# Altium schematic sheet STM32H730_PINOUT.SchDoc
size D; SheetNumber: 4; SheetTotal: 4
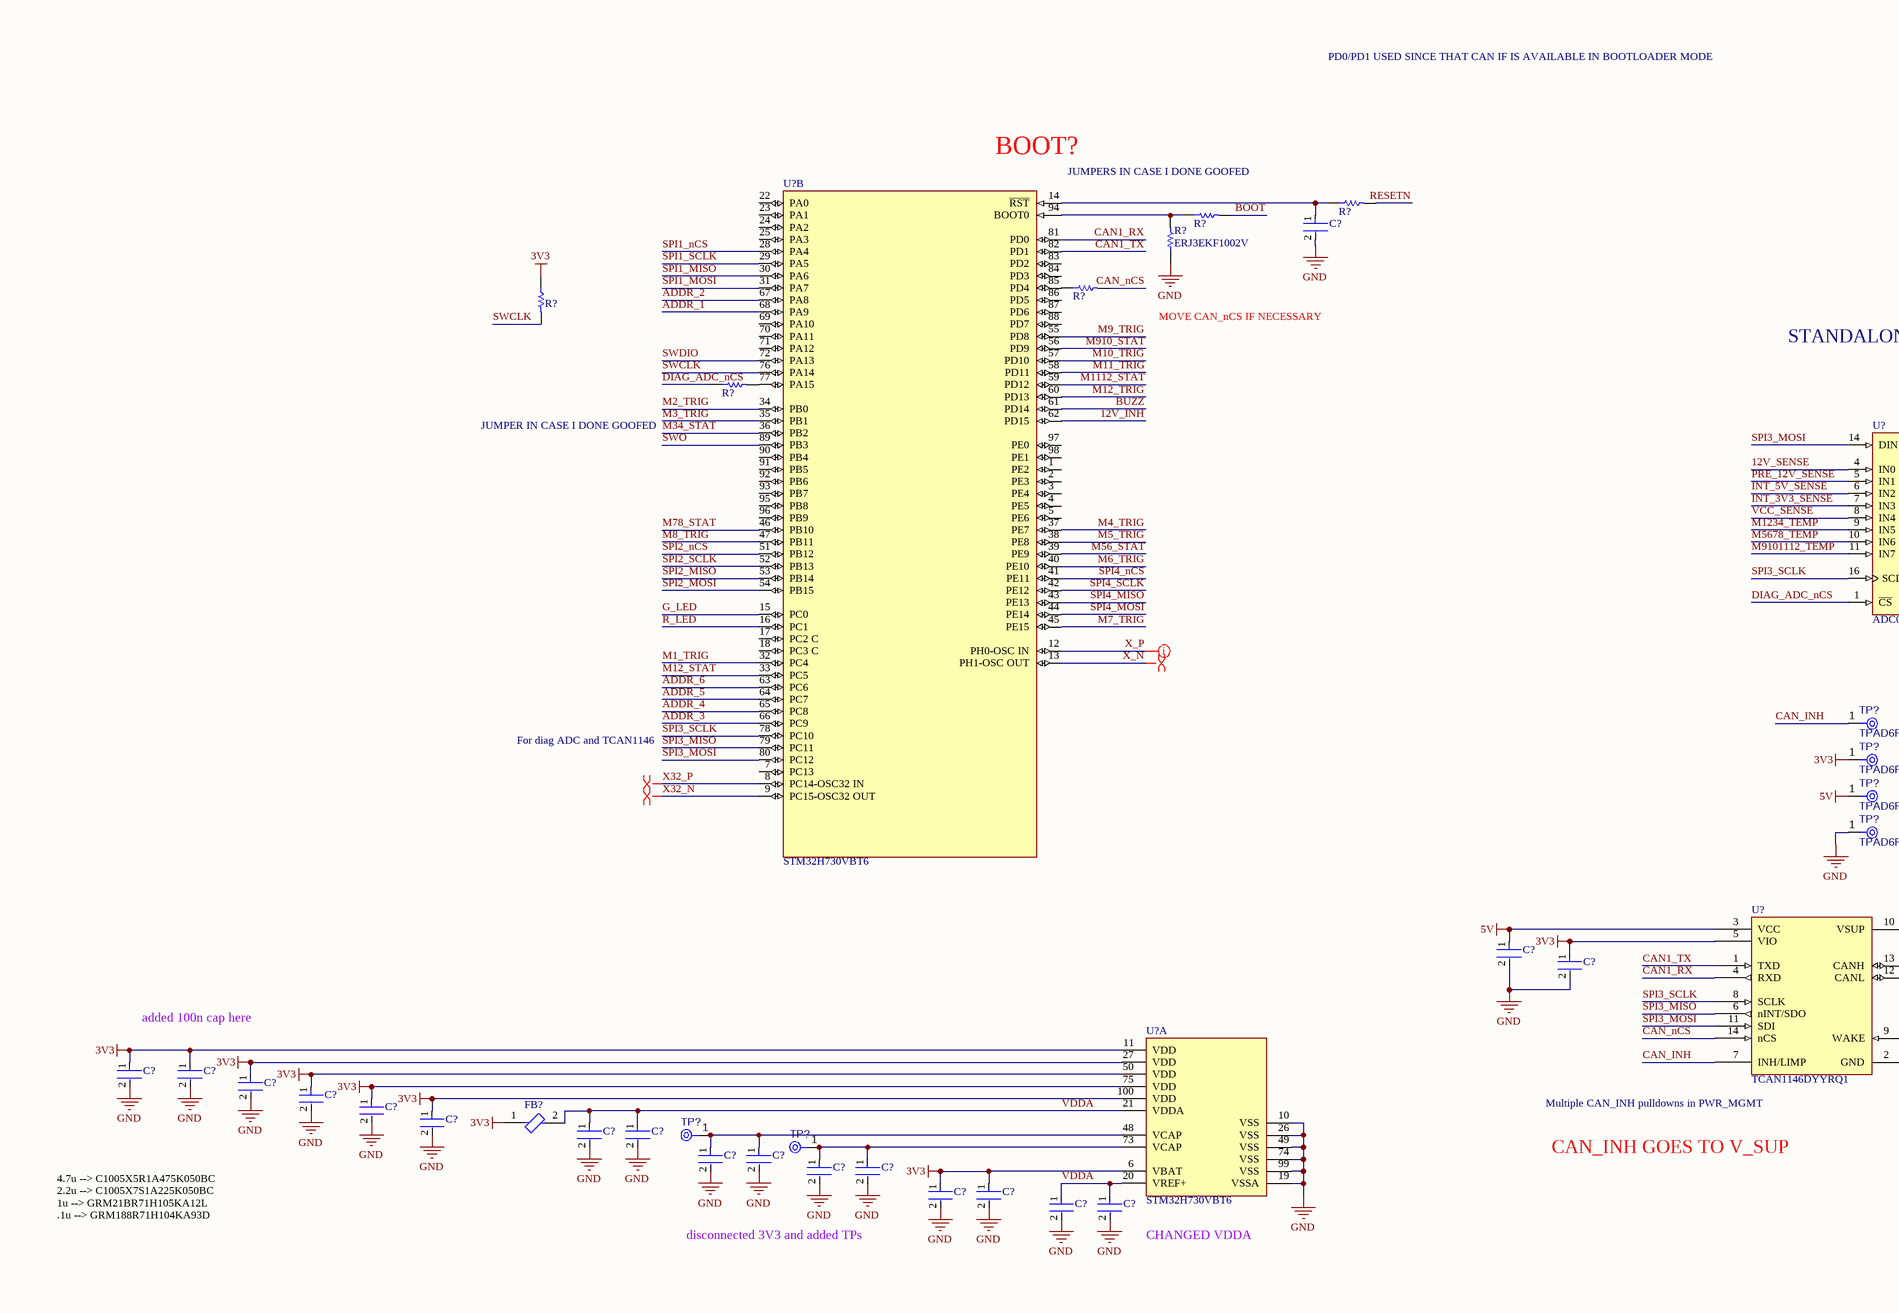
[diagram p0: STM32H730_PINOUT.SchDoc, top left]
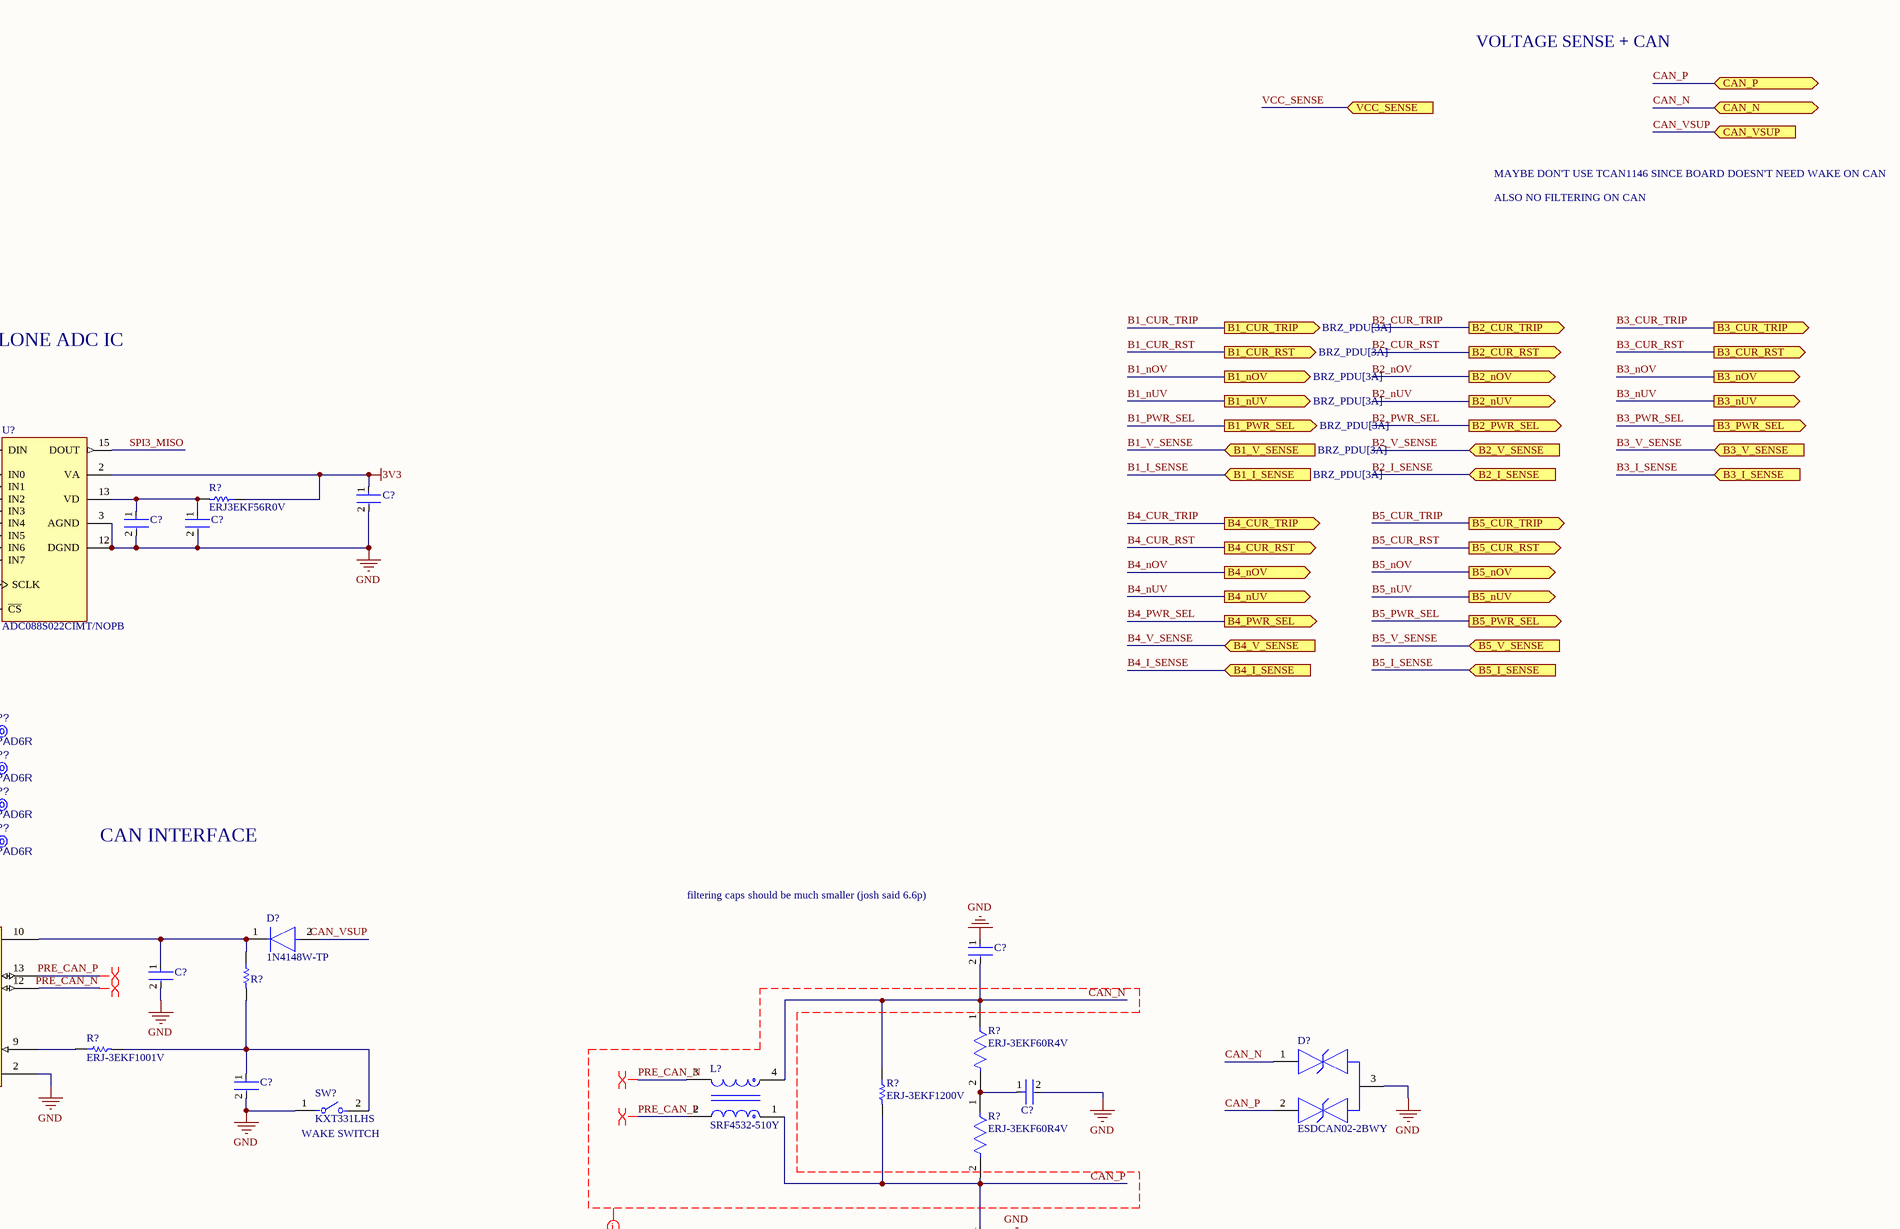
[diagram p1: STM32H730_PINOUT.SchDoc, top right]
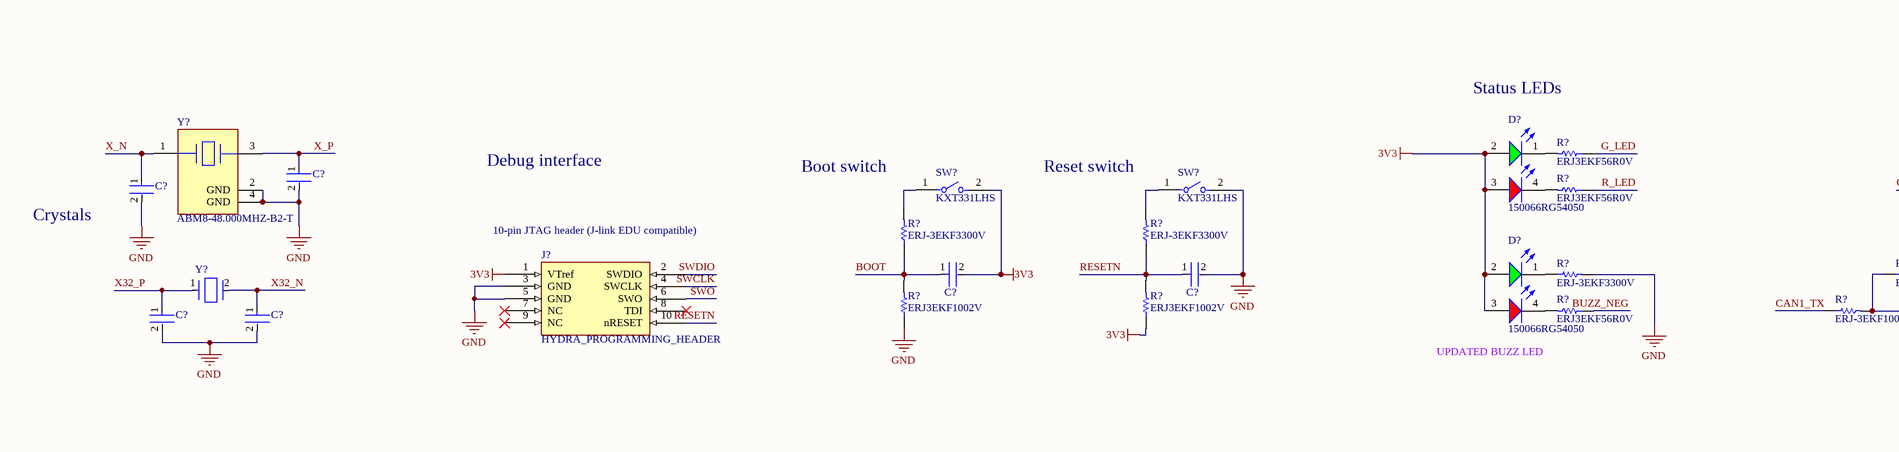
[diagram p2: STM32H730_PINOUT.SchDoc, bottom left]
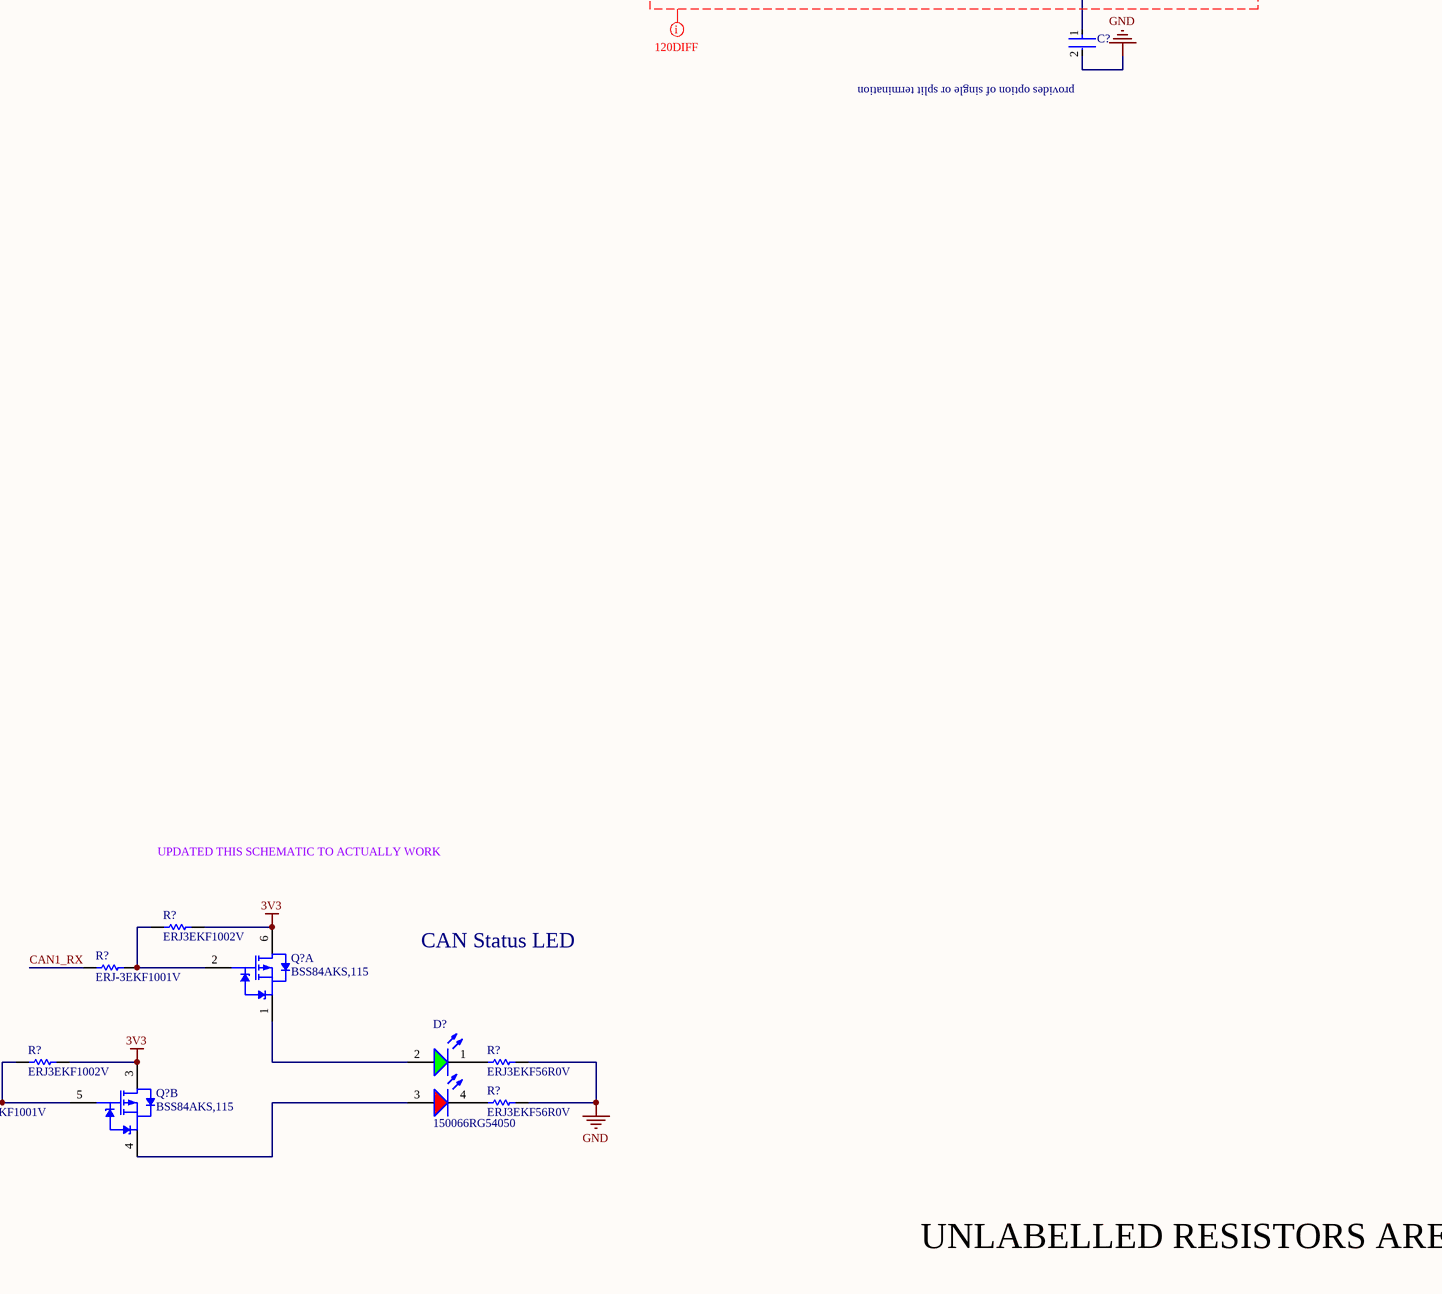
[diagram p3: STM32H730_PINOUT.SchDoc, bottom right]

## Parts
(Parts that share a designator on the sheet are numbered #1, #2 ... from top to bottom, then left to right.)
C?#1  GRM188R71H104KA93D  [FP-0402-L_1_0_0_05-W_0_5-IPC_A]  (value not drawn)
C?#2  GRM188R71H104KA93D  [FP-0402-L_1_0_0_05-W_0_5-IPC_A]  (value not drawn)
C?#3  GRM188R71H104KA93D  [FP-0402-L_1_0_0_05-W_0_5-IPC_A]  (value not drawn)
C?#4  GRM188R71H104KA93D  [FP-0402-L_1_0_0_05-W_0_5-IPC_A]  (value not drawn)
C?#5  DNO  [FP-0402-L_1_0_0_05-W_0_5-IPC_A]  (value not drawn)
C?#6  GRM188R71H104KA93D  [FP-0402-L_1_0_0_05-W_0_5-IPC_A]  (value not drawn)
C?#7  GRM188R71H104KA93D  [FP-0402-L_1_0_0_05-W_0_5-IPC_A]  (value not drawn)
C?#8  GRM188R71H104KA93D  [FP-0402-L_1_0_0_05-W_0_5-IPC_A]  (value not drawn)
C?#9  C1005X5R1A475K050BC  [FP-0402-L_1_0_0_05-W_0_5-IPC_A]  (value not drawn)
C?#10  GRM188R71H104KA93D  [FP-0402-L_1_0_0_05-W_0_5-IPC_A]  (value not drawn)
C?#11  GRM188R71H104KA93D  [FP-0402-L_1_0_0_05-W_0_5-IPC_A]  (value not drawn)
C?#12  GRM188R71H104KA93D  [FP-0402-L_1_0_0_05-W_0_5-IPC_A]  (value not drawn)
C?#13  GRM188R71H104KA93D  [FP-0402-L_1_0_0_05-W_0_5-IPC_A]  (value not drawn)
C?#14  GRM188R71H104KA93D  [FP-0402-L_1_0_0_05-W_0_5-IPC_A]  (value not drawn)
C?#15  GRM188R71H104KA93D  [FP-0402-L_1_0_0_05-W_0_5-IPC_A]  (value not drawn)
C?#16  GRM188R71H104KA93D  [FP-0402-L_1_0_0_05-W_0_5-IPC_A]  (value not drawn)
C?#17  GRM21BR71H105KA12L  [FP-0402-L_1_0_0_05-W_0_5-IPC_A]  (value not drawn)
C?#18  GRM188R71H104KA93D  [FP-0402-L_1_0_0_05-W_0_5-IPC_A]  (value not drawn)
C?#19  C1005X7S1A225K050BC  [FP-0402-L_1_0_0_05-W_0_5-IPC_A]  (value not drawn)
C?#20  GRM188R71H104KA93D  [FP-0402-L_1_0_0_05-W_0_5-IPC_A]  (value not drawn)
C?#21  C1005X7S1A225K050BC  [FP-0402-L_1_0_0_05-W_0_5-IPC_A]  (value not drawn)
C?#22  GRM188R71H104KA93D  [FP-0402-L_1_0_0_05-W_0_5-IPC_A]  (value not drawn)
C?#23  GRM21BR71H105KA12L  [FP-0402-L_1_0_0_05-W_0_5-IPC_A]  (value not drawn)
C?#24  GRM188R71H104KA93D  [FP-0402-L_1_0_0_05-W_0_5-IPC_A]  (value not drawn)
C?#25  GRM21BR71H105KA12L  [FP-0402-L_1_0_0_05-W_0_5-IPC_A]  (value not drawn)
C?#26  GRM188R71H104KA93D  [FP-0402-L_1_0_0_05-W_0_5-IPC_A]  (value not drawn)
C?#27  DNO  [FP-0402-L_1_0_0_05-W_0_5-IPC_A]  (value not drawn)
C?#28  DNO  [FP-0402-L_1_0_0_05-W_0_5-IPC_A]  (value not drawn)
C?#29  DNO  [FP-0402-L_1_0_0_05-W_0_5-IPC_A]  (value not drawn)
C?#30  GRM188R71H104KA93D  [FP-0402-L_1_0_0_05-W_0_5-IPC_A]  (value not drawn)
C?#31  GRM188R71H104KA93D  [FP-0402-L_1_0_0_05-W_0_5-IPC_A]  (value not drawn)
C?#32  04025A180FAT2A  [FP-0402-L_1_0_0_05-W_0_5-IPC_A]  (value not drawn)
C?#33  04025A180FAT2A  [FP-0402-L_1_0_0_05-W_0_5-IPC_A]  (value not drawn)
D?#1  1N4148W-TP  [FP-SOD-123-IPC_A]
D?#2  ESDCAN02-2BWY  [FP-SOT323-3L-MFG]
D?#3  150066RG54050  [WL-SBCD_0606]
D?#4  150066RG54050  [WL-SBCD_0606]
D?#5  150066RG54050  [WL-SBCD_0606]
FB?  BLM15PX601SN1D  [FP-BLM15-0_05-MFG]  (value not drawn)
J?  HYDRA_PROGRAMMING_HEADER  [3220-10-0300-00-Footprint-1]
L?  SRF4532-510Y  [FP-SRF4532-MFG]
Q?#1  BSS84AKS,115  [NXP-SOT363_L]  (part A of 2)
Q?#2  BSS84AKS,115  [NXP-SOT363_L]  (part B of 2)
R?#1  0402 JUMPER 0 OHM  [RESC1005X40X25NL05T05]  (value not drawn)
R?#2  0402 JUMPER 0 OHM  [RESC1005X40X25NL05T05]  (value not drawn)
R?#3  ERJ3EKF1002V  [RESC1609X55X30LL15T15]
R?#4  0402 JUMPER 0 OHM  [RESC1005X40X25NL05T05]  (value not drawn)
R?#5  ERJ3EKF1002V  [RESC1609X55X30LL15T15]  (value not drawn)
R?#6  0402 JUMPER 0 OHM  [RESC1005X40X25NL05T05]  (value not drawn)
R?#7  ERJ3EKF56R0V  [RESC1608X55X30NL15T15]
R?#8  ERJ3EKF1002V  [RESC1609X55X30LL15T15]  (value not drawn)
R?#9  ERJ-3EKF60R4V  [FP-ERJ3EK-IPC_C]
R?#10  ERJ-3EKF1001V  [RESC1608X55X30LL15T15]
R?#11  ERJ-3EKF1200V  [RESC1609X55X30ML15T15]
R?#12  ERJ-3EKF60R4V  [FP-ERJ3EK-IPC_C]
R?#13  ERJ3EKF1002V  [RESC1609X55X30LL15T15]
R?#14  ERJ3EKF56R0V  [RESC1608X55X30NL15T15]
R?#15  ERJ-3EKF1001V  [RESC1608X55X30LL15T15]
R?#16  ERJ3EKF56R0V  [RESC1608X55X30NL15T15]
R?#17  ERJ-3EKF3300V  [RESC1608X55X30LL15T15]
R?#18  ERJ-3EKF3300V  [RESC1608X55X30LL15T15]
R?#19  ERJ-3EKF3300V  [RESC1608X55X30LL15T15]
R?#20  ERJ3EKF1002V  [RESC1609X55X30LL15T15]
R?#21  ERJ3EKF56R0V  [RESC1608X55X30NL15T15]
R?#22  ERJ-3EKF1001V  [RESC1608X55X30LL15T15]
R?#23  ERJ3EKF1002V  [RESC1609X55X30LL15T15]
R?#24  ERJ3EKF1002V  [RESC1609X55X30LL15T15]
R?#25  ERJ3EKF56R0V  [RESC1608X55X30NL15T15]
R?#26  ERJ3EKF56R0V  [RESC1608X55X30NL15T15]
SW?#1  KXT331LHS  [FP-KXT331LHS-MFG]
SW?#2  KXT331LHS  [FP-KXT331LHS-MFG]
SW?#3  KXT331LHS  [FP-KXT331LHS-MFG]
TP?#1  TPAD6R  [TP06R]  (no BOM)
TP?#2  TPAD6R  [TP06R]  (no BOM)
TP?#3  TPAD6R  [TP06R]  (no BOM)
TP?#4  TPAD6R  [TP06R]  (no BOM)
TP?#5  TPAD6R  [TP06R]  (value not drawn)  (no BOM)
TP?#6  TPAD6R  [TP06R]  (value not drawn)  (no BOM)
U?#1  STM32H730VBT6  [FP-LQFP100-1L-IPC_C]  (part B of 2)
U?#2  ADC088S022CIMT/NOPB  [MTC16_L]
U?#3  TCAN1146DYYRQ1  [TCAN1146DYYRQ1-Footprint-1]
U?#4  STM32H730VBT6  [FP-LQFP100-1L-IPC_C]  (part A of 2)
Y?#1  ABM8-48.000MHZ-B2-T  [FP-ABM8-MFG]
Y?#2  ECS-.327-12.5-1210-TR  [FP-ECX-1210-MFG]  (value not drawn)

## Ports
B1_CUR_RST (out, see BRZ_PDU[3A]), B1_CUR_TRIP (out, see BRZ_PDU[3A]), B1_I_SENSE (in, see BRZ_PDU[3A]), B1_nOV (out, see BRZ_PDU[3A]), B1_nUV (out, see BRZ_PDU[3A]), B1_PWR_SEL (out, see BRZ_PDU[3A]), B1_V_SENSE (in, see BRZ_PDU[3A]), B2_CUR_RST (out), B2_CUR_TRIP (out), B2_I_SENSE (in), B2_nOV (out), B2_nUV (out), B2_PWR_SEL (out), B2_V_SENSE (in), B3_CUR_RST (out), B3_CUR_TRIP (out), B3_I_SENSE (in), B3_nOV (out), B3_nUV (out), B3_PWR_SEL (out), B3_V_SENSE (in), B4_CUR_RST (out), B4_CUR_TRIP (out), B4_I_SENSE (in), B4_nOV (out), B4_nUV (out), B4_PWR_SEL (out), B4_V_SENSE (in), B5_CUR_RST (out), B5_CUR_TRIP (out), B5_I_SENSE (in), B5_nOV (out), B5_nUV (out), B5_PWR_SEL (out), B5_V_SENSE (in), CAN_N (bidir), CAN_P (bidir), CAN_VSUP (in), VCC_SENSE (in)

## Nets
3V3: C?#2.1 C?#7.1 C?#9.1 C?#10.1 C?#12.1 C?#14.1 C?#15.1 C?#16.1 C?#23.1 C?#24.1 C?#30.2 D?#3.2(A) D?#3.3(A) D?#4.2(A) D?#4.3(A) FB?.1 J?.1(VTref) Q?#1.6(D1) Q?#2.3(D2) R?#5.1 R?#7.1 R?#13.2 R?#20.2 R?#24.1 SW?#2.2 TP?#2.1(TP) U?#2.2(VA) U?#3.5(VIO) U?#4.6(VBAT) U?#4.11(VDD) U?#4.27(VDD) U?#4.50(VDD) U?#4.75(VDD) U?#4.100(VDD)
5V: C?#6.1 TP?#3.1(TP) U?#3.3(VCC)
GND: C?#1.2 C?#2.2 C?#3.2 C?#4.2 C?#5.1 C?#6.2 C?#7.2 C?#8.2 C?#9.2 C?#10.2 C?#11.2 C?#12.2 C?#13.2 C?#14.2 C?#15.2 C?#16.2 C?#17.2 C?#18.2 C?#19.2 C?#20.2 C?#21.2 C?#22.2 C?#23.2 C?#24.2 C?#25.2 C?#26.2 C?#27.2 C?#28.2 C?#29.2 C?#31.2 C?#32.2 C?#33.2 D?#2.3 J?.3(GND) J?.5(GND) R?#3.1 R?#19.2 R?#21.1 R?#23.1 R?#26.1 SW?#1.1 SW?#3.2 TP?#4.1(TP) U?#2.3(AGND) U?#2.12(DGND) U?#3.2(GND) U?#4.10(VSS) U?#4.19(VSSA) U?#4.26(VSS) U?#4.49(VSS) U?#4.74(VSS) U?#4.99(VSS) Y?#1.2(GND) Y?#1.4(GND)
12V_INH: U?#1.62(PD15)
12V_SENSE: U?#2.4(IN0)
ADDR_1: U?#1.68(PA9)
ADDR_2: U?#1.67(PA8)
ADDR_3: U?#1.66(PC9)
ADDR_4: U?#1.65(PC8)
ADDR_5: U?#1.64(PC7)
ADDR_6: U?#1.63(PC6)
B1_CUR_RST: port B1_CUR_RST
B1_CUR_TRIP: port B1_CUR_TRIP
B1_I_SENSE: port B1_I_SENSE
B1_nOV: port B1_nOV
B1_nUV: port B1_nUV
B1_PWR_SEL: port B1_PWR_SEL
B1_V_SENSE: port B1_V_SENSE
B2_CUR_RST: port B2_CUR_RST
B2_CUR_TRIP: port B2_CUR_TRIP
B2_I_SENSE: port B2_I_SENSE
B2_nOV: port B2_nOV
B2_nUV: port B2_nUV
B2_PWR_SEL: port B2_PWR_SEL
B2_V_SENSE: port B2_V_SENSE
B3_CUR_RST: port B3_CUR_RST
B3_CUR_TRIP: port B3_CUR_TRIP
B3_I_SENSE: port B3_I_SENSE
B3_nOV: port B3_nOV
B3_nUV: port B3_nUV
B3_PWR_SEL: port B3_PWR_SEL
B3_V_SENSE: port B3_V_SENSE
B4_CUR_RST: port B4_CUR_RST
B4_CUR_TRIP: port B4_CUR_TRIP
B4_I_SENSE: port B4_I_SENSE
B4_nOV: port B4_nOV
B4_nUV: port B4_nUV
B4_PWR_SEL: port B4_PWR_SEL
B4_V_SENSE: port B4_V_SENSE
B5_CUR_RST: port B5_CUR_RST
B5_CUR_TRIP: port B5_CUR_TRIP
B5_I_SENSE: port B5_I_SENSE
B5_nOV: port B5_nOV
B5_nUV: port B5_nUV
B5_PWR_SEL: port B5_PWR_SEL
B5_V_SENSE: port B5_V_SENSE
BOOT: C?#30.1 R?#2.2 R?#17.1 R?#23.2
BUZZ: U?#1.61(PD14)
BUZZ_NEG: R?#25.1
CAN1_RX: R?#15.1 U?#1.81(PD0) U?#3.4(RXD)
CAN1_TX: R?#22.1 U?#1.82(PD1) U?#3.1(TXD)
CAN_INH: TP?#1.1(TP) U?#3.7(INH/LIMP)
CAN_N: C?#5.2 D?#2.1 L?.4 R?#9.1 R?#11.1 ; port CAN_N
CAN_nCS: R?#4.2 U?#3.14(nCS)
CAN_P: C?#27.1 D?#2.2 L?.1 R?#11.2 R?#12.2 ; port CAN_P
CAN_VSUP: D?#1.2(A) ; port CAN_VSUP
DIAG_ADC_nCS: R?#6.1 U?#2.1(~{CS})
G_LED: R?#14.1 U?#1.15(PC0)
INT_3V3_SENSE: U?#2.7(IN3)
INT_5V_SENSE: U?#2.6(IN2)
M1_TRIG: U?#1.32(PC4)
M2_TRIG: U?#1.34(PB0)
M3_TRIG: U?#1.35(PB1)
M4_TRIG: U?#1.37(PE7)
M5_TRIG: U?#1.38(PE8)
M6_TRIG: U?#1.40(PE10)
M7_TRIG: U?#1.45(PE15)
M8_TRIG: U?#1.47(PB11)
M9_TRIG: U?#1.55(PD8)
M10_TRIG: U?#1.57(PD10)
M11_TRIG: U?#1.58(PD11)
M12_STAT: U?#1.33(PC5)
M12_TRIG: U?#1.60(PD13)
M34_STAT: U?#1.36(PB2)
M56_STAT: U?#1.39(PE9)
M78_STAT: U?#1.46(PB10)
M910_STAT: U?#1.56(PD9)
M1112_STAT: U?#1.59(PD12)
M1234_TEMP: U?#2.9(IN5)
M5678_TEMP: U?#2.10(IN6)
M9101112_TEMP: U?#2.11(IN7)
PRE_12V_SENSE: U?#2.5(IN1)
PRE_CAN_N: L?.3 U?#3.12(CANL)
PRE_CAN_P: L?.2 U?#3.13(CANH)
R_LED: R?#16.1 U?#1.16(PC1)
RESETN: C?#31.1 J?.10(nRESET) R?#1.2 R?#18.1 R?#24.2
SPI1_MISO: U?#1.30(PA6)
SPI1_MOSI: U?#1.31(PA7)
SPI1_nCS: U?#1.28(PA4)
SPI1_SCLK: U?#1.29(PA5)
SPI2_MISO: U?#1.53(PB14)
SPI2_MOSI: U?#1.54(PB15)
SPI2_nCS: U?#1.51(PB12)
SPI2_SCLK: U?#1.52(PB13)
SPI3_MISO: U?#1.79(PC11) U?#2.15(DOUT) U?#3.6(nINT/SDO)
SPI3_MOSI: U?#1.80(PC12) U?#2.14(DIN) U?#3.11(SDI)
SPI3_SCLK: U?#1.78(PC10) U?#2.16(SCLK) U?#3.8(SCLK)
SPI4_MISO: U?#1.43(PE13)
SPI4_MOSI: U?#1.44(PE14)
SPI4_nCS: U?#1.41(PE11)
SPI4_SCLK: U?#1.42(PE12)
SWCLK: J?.4(SWCLK) R?#5.2 U?#1.76(PA14)
SWDIO: J?.2(SWDIO) U?#1.72(PA13)
SWO: J?.6(SWO) U?#1.89(PB3)
VCC_SENSE: U?#2.8(IN4) ; port VCC_SENSE
VDDA: C?#17.1 C?#18.1 C?#25.1 C?#26.1 FB?.2 U?#4.20(VREF+) U?#4.21(VDDA)
X32_N: C?#33.1 U?#1.9(PC15-OSC32_OUT) Y?#2.2(Out/In)
X32_P: C?#32.1 U?#1.8(PC14-OSC32_IN) Y?#2.1(In/Out)
X_N: C?#29.1 U?#1.13(PH1-OSC_OUT) Y?#1.1
X_P: C?#28.1 U?#1.12(PH0-OSC_IN) Y?#1.3
NetC?#1_1: C?#1.1 R?#1.1 U?#1.14(~{RST})
NetC?#3_1: C?#3.1 C?#4.1 R?#7.2 U?#2.13(VD)
NetC?#8_1: C?#8.1 D?#1.1(C) R?#8.1 U?#3.10(VSUP)
NetC?#11_1: C?#11.1 R?#8.2 R?#10.2 SW?#1.2
NetC?#13_1: C?#13.1 R?#9.2 R?#12.1
NetC?#19_1: C?#19.1 C?#20.1 TP?#5.1(TP) U?#4.48(VCAP)
NetC?#21_1: C?#21.1 C?#22.1 TP?#6.1(TP) U?#4.73(VCAP)
NetD?#3_1: D?#3.1(K) R?#14.2
NetD?#3_4: D?#3.4(K) R?#16.2
NetD?#4_1: D?#4.1(K) R?#19.1
NetD?#4_4: D?#4.4(K) R?#25.2
NetD?#5_1: D?#5.1(K) R?#21.2
NetD?#5_2: D?#5.2(A) Q?#1.1(S1)
NetD?#5_3: D?#5.3(A) Q?#2.4(S2)
NetD?#5_4: D?#5.4(K) R?#26.2
NetQ?#1_2: Q?#1.2(G1) R?#13.1 R?#15.2
NetQ?#2_5: Q?#2.5(G2) R?#20.1 R?#22.2
NetR?#2_1: R?#2.1 R?#3.2 U?#1.94(BOOT0)
NetR?#4_1: R?#4.1 U?#1.85(PD4)
NetR?#6_2: R?#6.2 U?#1.77(PA15)
NetR?#10_1: R?#10.1 U?#3.9(WAKE)
NetR?#17_2: R?#17.2 SW?#2.1
NetR?#18_2: R?#18.2 SW?#3.1

Not connected (* = marked no-connect by the designer): J? 7(NC)* 8(TDI)* 9(NC)*; U?#1 1(PE2) 2(PE3) 3(PE4) 4(PE5) 5(PE6) 7(PC13) 17(PC2_C) 18(PC3_C) 22(PA0) 23(PA1) 24(PA2) 25(PA3) 69(PA10) 70(PA11) 71(PA12) 83(PD2) 84(PD3) 86(PD5) 87(PD6) 88(PD7) 90(PB4) 91(PB5) 92(PB6) 93(PB7) 95(PB8) 96(PB9) 97(PE0) 98(PE1)

## Layout directives
differential pair: PRE_CAN_N, PRE_CAN_P, X32_N, X32_P, X_N, X_P
net class 120DIFF: CAN_N, CAN_P, PRE_CAN_N, PRE_CAN_P

## Notes on the sheet
- PD0/PD1 USED SINCE THAT CAN IF IS AVAILABLE IN BOOTLOADER MODE
- VOLTAGE SENSE + CAN
- (near U?#1) BOOT?
- JUMPERS IN CASE I DONE GOOFED
- MAYBE DON'T USE TCAN1146 SINCE BOARD DOESN'T NEED WAKE ON CAN
- ALSO NO FILTERING ON CAN
- MOVE CAN_nCS IF NECESSARY
- STANDALONE ADC IC
- JUMPER IN CASE I DONE GOOFED
- For diag ADC and TCAN1146
- CAN INTERFACE
- (near C?#5) filtering caps should be much smaller (josh said 6.6p)
- (near C?#10) added 100n cap here
- (near U?#3) Multiple CAN_INH pulldowns in PWR_MGMT
- (near SW?#1) WAKE SWITCH
- CAN_INH GOES TO V_SUP
- disconnected 3V3 and added TPs
- CHANGED VDDA
- 4.7u --> C1005X5R1A475K050BC
  2.2u --> C1005X7S1A225K050BC
  1u --> GRM21BR71H105KA12L
  .1u --> GRM188R71H104KA93D
- (near C?#27) provides option of single or split termination
- Status LEDs
- UPDATED THIS SCHEMATIC TO ACTUALLY WORK
- Debug interface
- Boot switch
- Reset switch
- CAN Status LED
- (near C?#29) Crystals
- (near J?) 10-pin JTAG header (J-link EDU compatible)
- UPDATED BUZZ LED
- UNLABELLED RESISTORS ARE JUMPERS

## Library data of the parts
C?#1-C?#33 = CMP-001-00058-1: LARGE PADS, 0402 CAP, CHANGE COMMENT TO MATCH REAL P/N; Capacitor Type: Ceramic; Min Operating Temperature: -55°C; Mounting Technology: Surface Mount; Pins: 2; Case/Package: 0402; RoHS Compliant: Yes; Max Operating Temperature: 85°C
D?#1 = CMP-2000-04993-2: DIODE GEN PURP 100V 150MA SOD123; Max Reverse Leakage Current: 5uA; Max Surge Current: 2A; Reverse Recovery Time: 4ns; Polarity: Standard; Capacitance: 4pF; Max Forward Surge Current (Ifsm): 1A; Element Configuration: Single; Power Dissipation: 400mW; Forward Voltage: 1V; Radiation Hardening: No; Lead Free: Lead Free; Max Reverse Voltage (DC): 100V; Current Rating: 150mA; Forward Current: 150mA; Packaging: Tape and Reel; Number of Pins: 2; Package Quantity: 3000; Max Operating Temperature: 150°C; Min Operating Temperature: -65°C; Average Rectified Current: 150mA; Recovery Time: 4ns; Output Current: 150mA; Peak Non-Repetitive Surge Current: 2A; Width: 1.8mm; Voltage Rating (DC): 100V; Height: 1.2mm; Max Repetitive Reverse Voltage (Vrrm): 100V; Mount: Surface Mount; Length: 2.85mm
D?#2 = CMP-12225-000055-1: TVS DIODE 26.5V 44V SOT323-3; Manufacturer: STMicroelectronics; Value: 3pF; Direction: Bidirectional; Breakdown Voltage: 28.5V; Automotive Grade: Grade 0; Standoff Height: 0mm; Peak Pulse Power: 170W; Peak Pulse Current: 3A; Number Of Channels: 2; Max Junction Temp: +175°C; Mouser Description: TVS Diodes / ESD Suppressors Automotive dual-line Transil, Transient voltage suppressor (TVS) for CAN bus; Height: 1.1mm; Category: Diode; Reverse Standoff Voltage: 26.5V; Device Class L1: Circuit Protection; Temperature: -55°C to +175°C; RoHS: TRUE; ComponentLink2URL: https://www.st.com/resource/en/datasheet/esdcan02-2bwy.pdf; Device Class L3: unset; Device Class L2: TVS Diodes; Temperature Range High: +175°C; Octopart: https://octopart.com/esdcan02-2bwy-stmicroelectronics-58631133; Ipc Land Pattern Name: SOT65P210X95-3; Temperature Range Low: -55°C; Capacitance: 3pF; Digikey Description: TVS DIODE 26.5V 44V SOT323-3; Automotive: Yes; ComponentLink2Description: Datasheet; Clamping Voltage: 44V; Manufacturer Part Number: ESDCAN02-2BWY; Lead Free: Yes; Package: SOT323-3L
D?#3-D?#5 = CMP-004-00034-2: Led, Red/Grn, 180Mcd/230Mcd, 624Nm/525Nm Rohs Compliant: Yes
FB? = CMP-0686-00252-4: Chip Ferrite Bead, 0402, 600Ω @ 100MHz, 0.23Ω, 25%, 900mA; Number of Circuits: 1; Impedance: 600R; DC Resistance (DCR): 230mR; Material: Steel; Length: 1mm; Package Quantity: 10000; Height: 0.5mm; Width: 0.5mm; Max DC Current: 900mA; Number of Lines: 1; Termination: SMD/SMT; Packaging: Tape and Reel; Lead Free: Lead Free; Min Operating Temperature: -55°C; Max Operating Temperature: 125°C; Max Current Rating: 900mA; Case Code (Imperial): 0402; Number of Pins: 2; Current Rating: 900mA; Test Frequency: 100MHz; Case/Package: 0402; Tolerance: 25%; Case Code (Metric): 1005
J? = CMP-002-00075-1: CONN HEADER SMD 10POS 1.27MM (specifically compatible with J-Link EDU cable) PN: 3220-10-0300-00
L? = CMP-07251-000006-1: CMC 51UH 200MA 2LN 2KOHM SMD; Element Configuration: Dual; Number of Lines: 2; Core Material: Ferrite; Impedance: 2kR; Test Frequency: 100kHz; Voltage Rating (DC): 50V; Insulation Resistance: 10MR; Material: Steel; Tolerance: 50%; DC Resistance (DCR): 3.5R; RoHS Compliant: Yes; Mount: Surface Mount; REACH SVHC: No SVHC; Termination: SMD/SMT; DC Current: 200mA; Current: 200mA; Lead Free: Lead Free; Contact Plating: Tin; Length: 4.5mm; Max DC Current: 200mA; Width: 0.126inch; Case/Package: 4532; Packaging: Tape and Reel; Package Quantity: 1; Min Operating Temperature: -40°C; Depth: 3.4mm; Series: SRF4532; Max Operating Temperature: 125°C; Current Rating: 200mA; Self Resonant Frequency: 100kHz; Height: 0.118inch; Inductance: 51uH; Resistance: 2kR
Q?#1 Q?#2 = CMP-1259-00116-1: Dual P-Channel Trench MOSFET, -50 V, -0.16 A, -55 to 150 degC, 6-Pin SOT363, Tape and Reel; Manufacturer: NXP Semiconductors; VGSth [typ] (V): -1.6; Automotive Qualified: Y; Channel Type: P; IDM [max] (A): -0.64; Packing: Tape & Reel; Mounting Technology: Surface Mount; PackageDescription: 6-Pin Small Outline Transistor Package, Body 2 x 1.25 mm, Pitch 0.65 mm; ComponentLink2URL: http://www.nxp.com/documents/data_sheet/BSS84AKS.pdf; ComponentLink3URL: http://www.nxp.com/documents/outline_drawing/sot363_po.pdf; PartNumber: BSS84AKS,115; PackageReference: SOT363; PackageVersion: 06-03-16, 03/2006; ComponentLink3Description: Package Specification; ComponentLink2Description: Datasheet; ComponentLink1Description: Manufacturer URL; VDS [max] (V): -50; Code_JEITA: SC-88; ID [max] (A): -0.16; DatasheetVersion: Rev. 1; ComponentLink1URL: http://www.nxp.com/
R?#1 R?#2 R?#4 R?#6 = CMP-009-00206-2: READ THE NAME
R?#3 R?#5 R?#8 R?#13 R?#20 R?#23 R?#24 = CMP-1012-00623-3: Chip Resistor, 10 KOhm, +/- 1%, 0.1 W, -55 to 155 degC, 0603 (1608 Metric), RoHS, Tape and Reel; Manufacturer: Panasonic; Voltage Rating: 75V; Case\/Package: 0603; Power Rating: 100mW; Resistance: 10KOhm; Temperature Coefficient: 100ppm\/degreesC; Number of Pins: 2; Package Reference: 603; Depth: 0.8mm; Mount: SurfaceMount; Package Description: 2-Pin Surface Mount Device, Body 1.6 x 0.85 mm; Datasheet Version: 02/2017; Length: 1.6mm; Lead Free: LeadFree; Height: 0.45mm; Number of Terminations: 2; Max Power Dissipation: 100mW; Min Operating Temperature: -55degC; Datasheet URL: https://industrial.panasonic.com/cdbs/www-data/pdf/RDA0000/AOA0000C304.pdf; Termination: SMD/SMT; Case Code (Metric): 1608; Case Code (Imperial): 0603; Tolerance: 1%; Max Operating Temperature: 155degC; RoHSCompliant: true; Voltage Rating (DC): 75V; Radiation Hardening: No; Packaging: TapeandReel; Composition: ThickFilm; Mounting Technology: SurfaceMount; Manufacturer URL: http://www.panasonic.com/; Width: 0.031inch; REACH SVHC: NoSVHC; Contact Plating: Tin; Military Standard: Not; Package Quantity: 1
R?#7 R?#14 R?#16 R?#21 R?#25 R?#26 = CMP-2000-00572-1: Manufacturer: Panasonic; Part Number: ERJ3EKF56R0V
R?#9 R?#12 = CMP-1012-00372-3: RES SMD 60.4 OHM 1% 1/10W 0603; Resistance: 60.4R; Voltage Rating (DC): 50V; Voltage Rating: 75V; Temperature Coefficient: 100ppm/°C; Power Rating: 100mW; Mount: Surface Mount; Number of Terminations: 2; Max Operating Temperature: 155°C; Case Code (Metric): 1608; Height: 0.022inch; Case/Package: 0603; Min Operating Temperature: -55°C; REACH SVHC: No SVHC; Series: ERJ; Features: Automotive AEC-Q200; Military Standard: Not; Lead Free: Lead Free; Width: 0.031inch; Case Code (Imperial): 0603; Resistance Tolerance: 1%; Packaging: Tape and Reel; Termination: SMD/SMT; Tolerance: 1%; Contact Plating: Tin; Depth: 0.8mm; Resistor Type: Thick Film; Construction: Rectangular; RoHS Compliant: Yes; Max Power Dissipation: 100mW; Package Quantity: 1; Length: 1.6mm
R?#10 R?#15 R?#22 = CMP-2000-00180-1: Manufacturer: Panasonic; Part Number: ERJ-3EKF1001V
R?#11 = CMP-2000-00213-2: Chip Resistor, 120 Ohm, +/- 1%, 0.1 W, -55 to 155 degC, 0603 (1608 Metric), RoHS, Tape and Reel; Manufacturer: Panasonic; Power Rating: 100mW; Voltage Rating (DC): 75V; Resistance: 120Ohm; Temperature Coefficient: 100ppm/degreesC; Number of Terminations: 2; Military Standard: Not; Tolerance: 1%; Min Operating Temperature: -55degC; Packaging: TapeandReel; Lead Free: LeadFree; Max Operating Temperature: 155degC; Manufacturer URL: http://www.panasonic.com/; Case Code (Imperial): 0603; REACH SVHC: NoSVHC; Width: 0.031inch; Datasheet URL: https://industrial.panasonic.com/cdbs/www-data/pdf/RDA0000/AOA0000C283.pdf; RoHSCompliant: true; Max Power Dissipation: 100mW; Termination: SMD/SMT; Package Reference: 0603; Height: 0.022inch; Depth: 0.8mm; Package Description: 2-Pin Surface Mount Device, Body 1.6 x 0.85 mm; Contact Plating: Tin; Length: 1.6mm; Package URL: http://www.st.com/st-web-ui/static/active/en/resource/technical/document/datasheet/CD00001320.pdf; Radiation Hardening: No; Package Quantity: 1; Number of Pins: 2; Datasheet Version: 42095.0; Voltage Rating: 75V; Composition: ThickFilm; Case/Package: 0603; Mount: SurfaceMount; Case Code (Metric): 1608
R?#17-R?#19 = CMP-2000-00435-2: Chip Resistor, 330 Ohm, +/- 1%, 0.1 W, -55 to 155 degC, 0603 (1608 Metric), RoHS, Tape and Reel; Gender: Male; Mating Cycles: 10000; Current Rating: 500 mA; Voltage Rating: 10 V; REACH SVHC: No SVHC; PackageDescription: 2-Pin Surface Mount Device, Body 1.6 x 0.85 mm; Contact Finish: Gold; Pins: 8; ComponentLink1Description: Manufacturer URL; Packaging: Tape and Reel; Max Operating Temperature: 85 degC; Contact Material: Copper; Height: 1.45 mm; Width: 1.45 mm; DatasheetVersion: Apr-15; Package Quantity: 1500; Contact Plating: Gold; PackageReference: 0603; Mount: Surface Mount; Lead Pitch: 1.1 mm; Min Operating Temperature: -25 degC; ComponentLink1URL: http://www.panasonic.com/; ComponentLink2URL: http://industrial.panasonic.com/cdbs/www-data/pdf/RDA0000/AOA0000C86.pdf; Length: 13.7 mm; ComponentLink2Description: Datasheet; RoHSCompliant: true
SW?#1-SW?#3 = CMP-10040-000029-1: SWITCH TACTILE SPST-NO 0.02A 15V; Operating Force: 240gf; Switch Travel: 0.13mm; Illumination Type: Non-Illuminated; Throw Configuration: SPST; Number of Ports: 1; Current Rating: 5A; Mechanical Life: 500000Cycles; Switch Function: Off-Mom; Connector Type: USB; Actuator Type: Standard; Gender: Receptacle; Number of Contacts: 24; Contact Plating: Gold; Insulation Color: Black; Min Operating Temperature: -40°C; Packaging: Tape and Reel; Flammability Rating: UL94 V-0; Max Operating Temperature: 85°C; Termination: Solder; Mount: Surface Mount
TP?#1-TP?#6 = CMP-00028-00002-2: 0.6mm round; Pins: 1
U?#1 U?#4 = CMP-12105-000107-1: IC MCU 32BIT 128KB FLASH 100LQFP
U?#2 = CMP-0054-00372-2: 8-Channel, 50 kSPS to 200 kSPS, 8-Bit A/D Converter, 16-pin TSSOP, Pb-Free; Manufacturer: National Semiconductor; PackageTopMarking: NSUZXYTT*88S022*CIMT; CompType: ADC IC; PowerWise: Y; ComponentLink2URL: http://www.national.com/pf/AD/ADC088S022.html; RoHS: Y; PackageDescription: Molded TSSOP, Jedec, 5 x 4.4 x 0.9mm Body, 16 Lead, 0.65mm Pitch; DatasheetVersion: Feb-2010; PinCount: 16; ComponentLink1Description: ADC088S022 Datasheet; Code_JEDEC: MO-153-AB; ComponentLink3URL: http://www.national.com/packaging/folders/mtc16.html; PackageVersion: revD, Jun-2003; ComponentLink3Description: MTC16 Package Page; RevisionNote: Component URLs added; ComponentLink1URL: http://www.national.com/ds/AD/ADC088S022.pdf; ComponentLink2Description: ADC088S022 Web Page; PackageReference: MTC16
U?#3 = CMP-015-00012-2: Automotive CAN FD transceiver with watchdog, bus diagnostics and partial networking via sele 14-SOT-23-THIN -40 to 150
Y?#1 = CMP-27762-011708-1: Crystal 48MHz ±20ppm 18pF SMD-4 3.2mm x 2.5mm; Series Resistance: 35R; Frequency Stability: 50ppm; Package Quantity: 1000; Packaging: Tape and Reel; Mount: Surface Mount; Length: 3.2mm; Load Capacitance: 18pF; Max Operating Temperature: 70°C; Operating Frequency: 48 MHz; RoHS Compliant: Yes; Series: ABM8; Frequency Tolerance: 20ppm; Lead Free: Lead Free; Min Operating Temperature: -20°C; Case/Package: CSMD; Number of Pins: 4; Height: 0.031inch; ESR (Equivalent Series Resistance): 35R; Frequency: 48MHz; Radiation Hardening: No; Width: 0.098inch; Tolerance: 20ppm; Termination: SMD/SMT; Depth: 2.5mm; Resistor Type: Ceramic; REACH SVHC: No SVHC
Y?#2 = CMP-40224-000006-1: CRYSTAL 32.7680KHZ 12.5PF SMD; Manufacturer: ECS International; Frequency: 32.768kHz; Esr: 90kΩ; Tolerance: 20ppm; Device Class L1: Passive Components; Load Capacitance: 12.5pF; Temperature: -40°C to +85°C; ComponentLink2URL: https://ecsxtal.com/store/pdf/ECX-1210.pdf; Series: ECX-1210; Octopart: https://octopart.com/ecs-.327-12.5-1210-tr-ecs+international-81221340; ComponentLink2Description: Datasheet; Temperature Range Low: -40°C; Digikey Description: CRYSTAL 32.7680KHZ 12.5PF SMD; Lead Free: Yes; RoHS: TRUE; Device Class L3: Crystals; Automotive: No; Category: Crys; Height: 0.5mm; Manufacturer Part Number: ECS-.327-12.5-1210-TR; Temperature Range High: +85°C; Device Class L2: Crystals / Oscillators; Package: ECX-1210